# EAGLE schematic DAQShield (EAGLE 9.6.0)
DOCUMENT_NUMBER: tbd; DOCUMENT_REVISION: ( ); RELEASE_DATE: tbd

## Sheet 1 of 6: Arduino Pro Micro
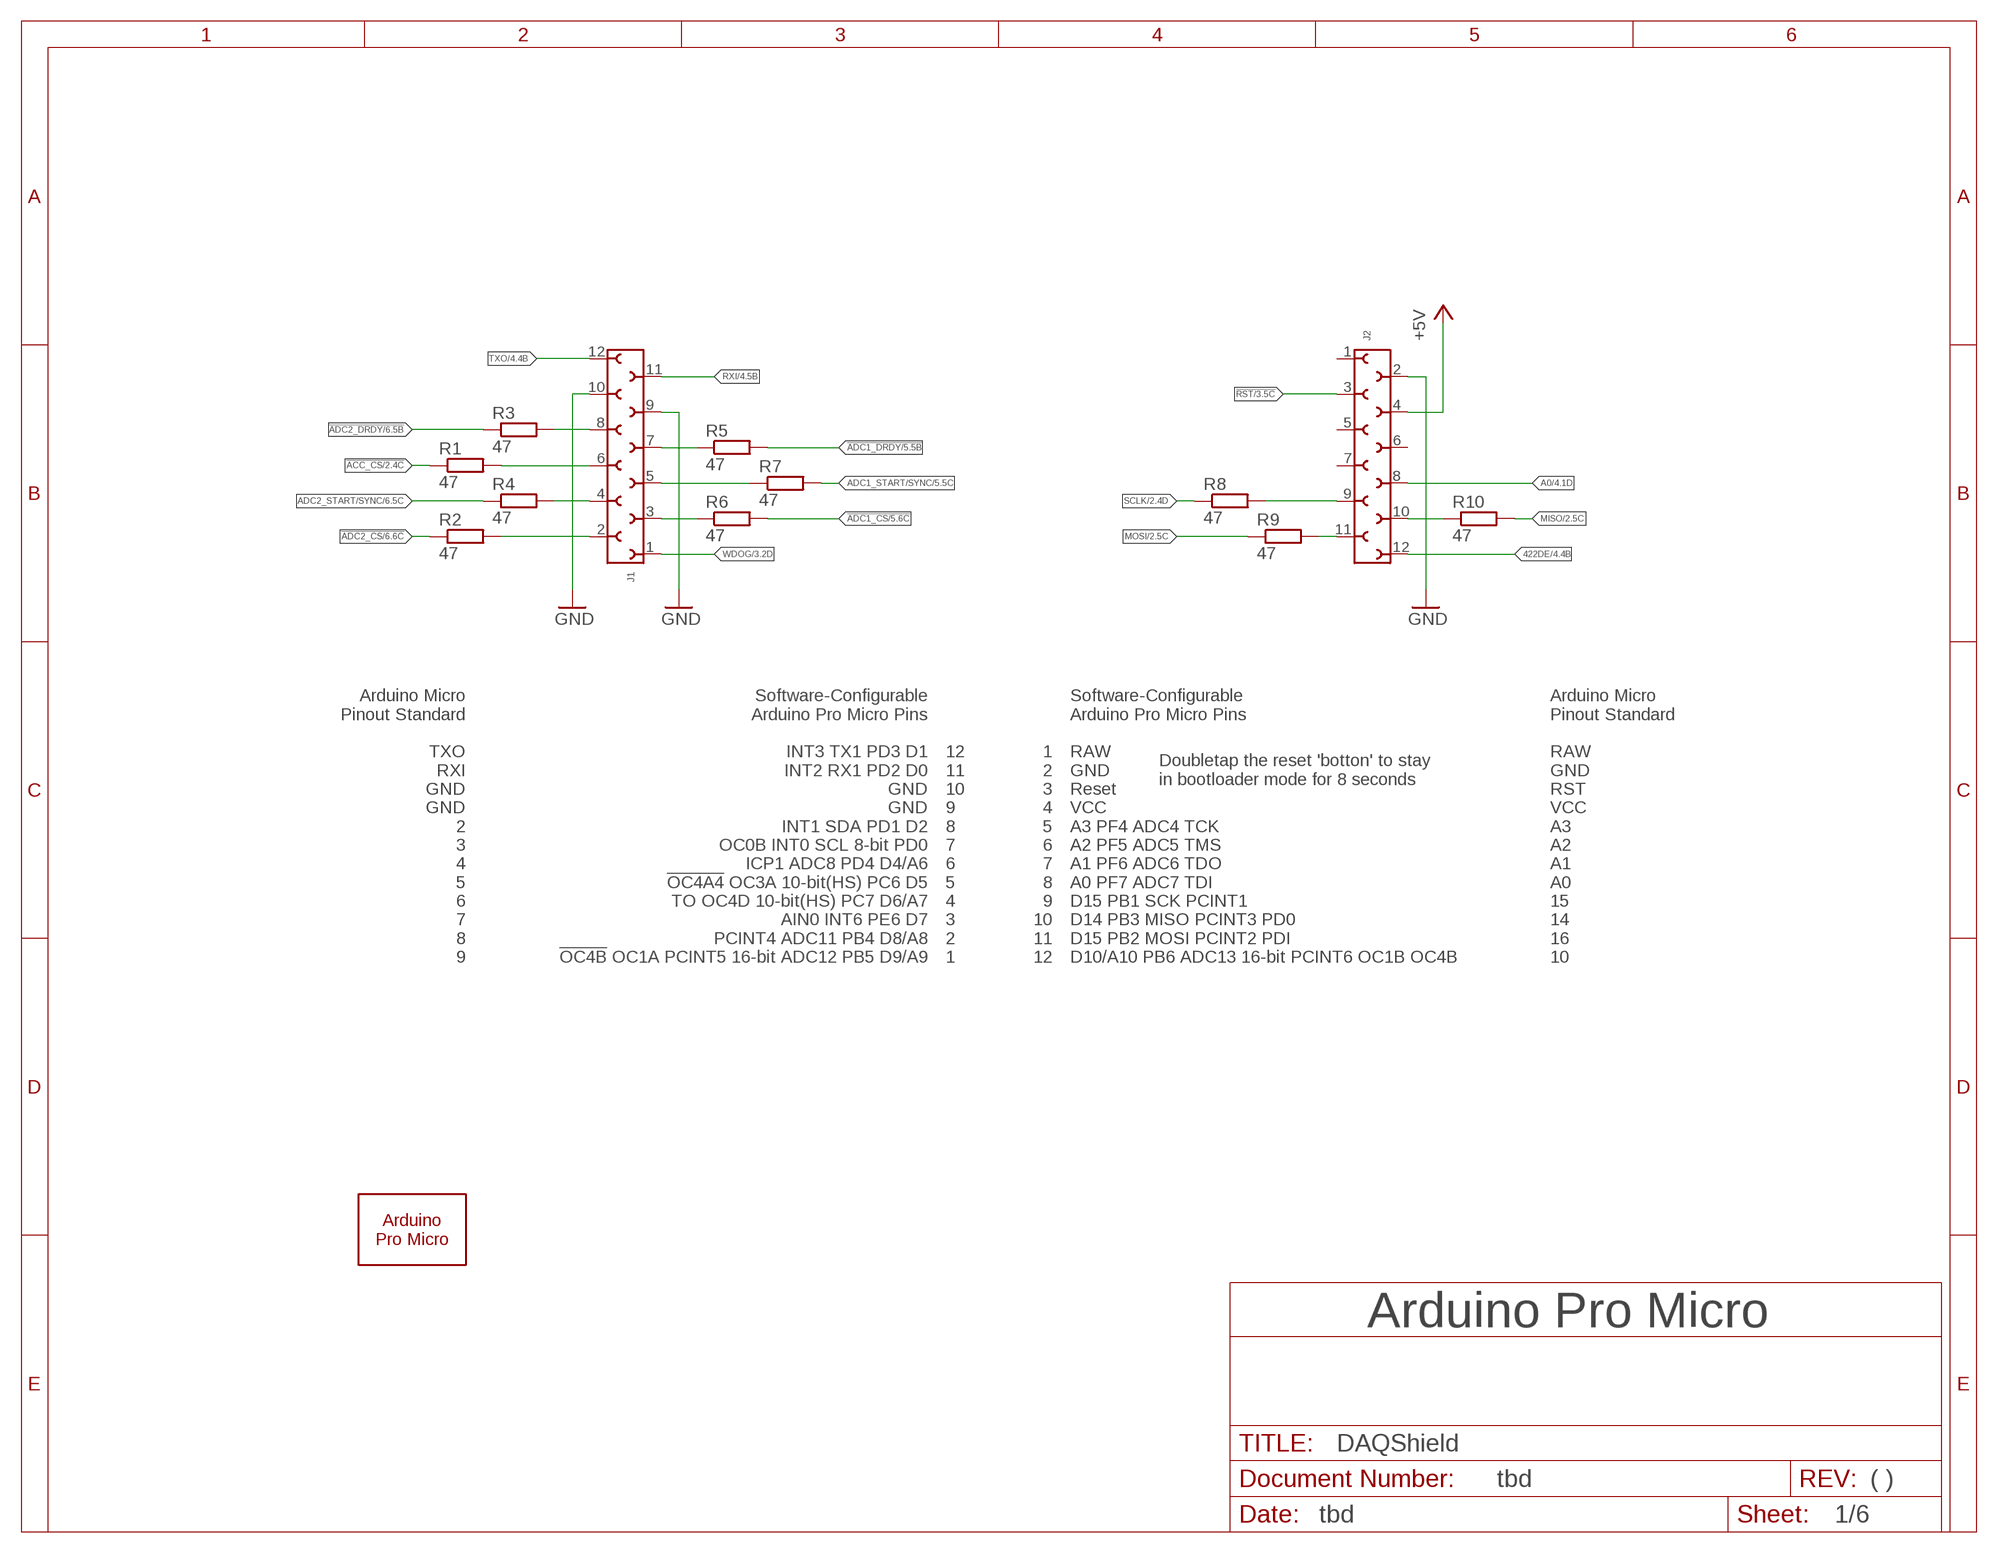
[diagram p0: schematic, sheet 1]

### Parts
A1  ARDUINO_PRO_MICRO  [ARDUINO_PRO_MICRO]
J1  6100XX13321_61001213321  [61001213321]
J2  6100XX13321_61001213321  [61001213321]
R1  47  R-EU_R0603  [R0603]
R2  47  R-EU_R0603  [R0603]
R3  47  R-EU_R0603  [R0603]
R4  47  R-EU_R0603  [R0603]
R5  47  R-EU_R0603  [R0603]
R6  47  R-EU_R0603  [R0603]
R7  47  R-EU_R0603  [R0603]
R8  47  R-EU_R0603  [R0603]
R9  47  R-EU_R0603  [R0603]
R10  47  R-EU_R0603  [R0603]

### Nets
422DE: J2.12 ; also sheet 4
!ACC_CS: R1.1 ; also sheet 2
!ADC1_CS: R6.2 ; also sheet 5
!ADC1_DRDY: R5.2 ; also sheet 5
!ADC2_CS: R2.1 ; also sheet 6
!ADC2_DRDY: R3.1 ; also sheet 6
!RST: J2.3 ; also sheet 3,5,6
+5V [Power]: J2.4 ; also sheet 2,3,4,5,6
A0: J2.8 ; also sheet 4
ADC1_START/SYNC: R7.2 ; also sheet 5
ADC2_START/SYNC: R4.1 ; also sheet 6
GND [Ground]: J1.9 J1.10 J2.2 ; also sheet 2,3,4,5,6
MISO: R10.2 ; also sheet 2,5,6
MOSI: R9.1 ; also sheet 2,5,6
N$19: J2.9 R8.2
N$20: J2.11 R9.2
N$21: J2.10 R10.1
N$22: J1.8 R3.2
N$23: J1.7 R5.1
N$28: J1.4 R4.2
N$32: J1.2 R2.2
N$35: J1.5 R7.1
N$36: J1.3 R6.1
N$41: J1.6 R1.2
RXI: J1.11 ; also sheet 4
SCLK: R8.1 ; also sheet 2,5,6
TXO: J1.12 ; also sheet 4
WDOG: J1.1 ; also sheet 3
Unconnected: J2.1 J2.5 J2.6 J2.7

### Notes on the sheet
- Doubletap the reset 'botton' to stay
  in bootloader mode for 8 seconds
- Arduino Micro
  Pinout Standard
  
  TXO
  RXI
  GND
  GND
  2
  3
  4
  5
  6
  7
  8
  9
- Software-Configurable
  Arduino Pro Micro Pins
  
  INT3 TX1 PD3 D1
  INT2 RX1 PD2 D0
  GND
  GND
  INT1 SDA PD1 D2
  OC0B INT0 SCL 8-bit PD0
  ICP1 ADC8 PD4 D4/A6
  !OC4A4! OC3A 10-bit(HS) PC6 D5
  TO OC4D 10-bit(HS) PC7 D6/A7
  AIN0 INT6 PE6 D7
  PCINT4 ADC11 PB4 D8/A8
  !OC4B! OC1A PCINT5 16-bit ADC12 PB5 D9/A9
- 12
  11
  10
  9
  8
  7
  6
  5
  4
  3
  2
  1
- 1
  2
  3
  4
  5
  6
  7
  8
  9
  10
  11
  12
- Software-Configurable
  Arduino Pro Micro Pins
  
  RAW
  GND
  Reset
  VCC
  A3 PF4 ADC4 TCK
  A2 PF5 ADC5 TMS
  A1 PF6 ADC6 TDO
  A0 PF7 ADC7 TDI
  D15 PB1 SCK PCINT1
  D14 PB3 MISO PCINT3 PD0
  D15 PB2 MOSI PCINT2 PDI
  D10/A10 PB6 ADC13 16-bit PCINT6 OC1B OC4B
- Arduino Micro
  Pinout Standard
  
  RAW
  GND
  RST
  VCC
  A3
  A2
  A1
  A0
  15
  14
  16
  10

## Sheet 2 of 6: Connectors
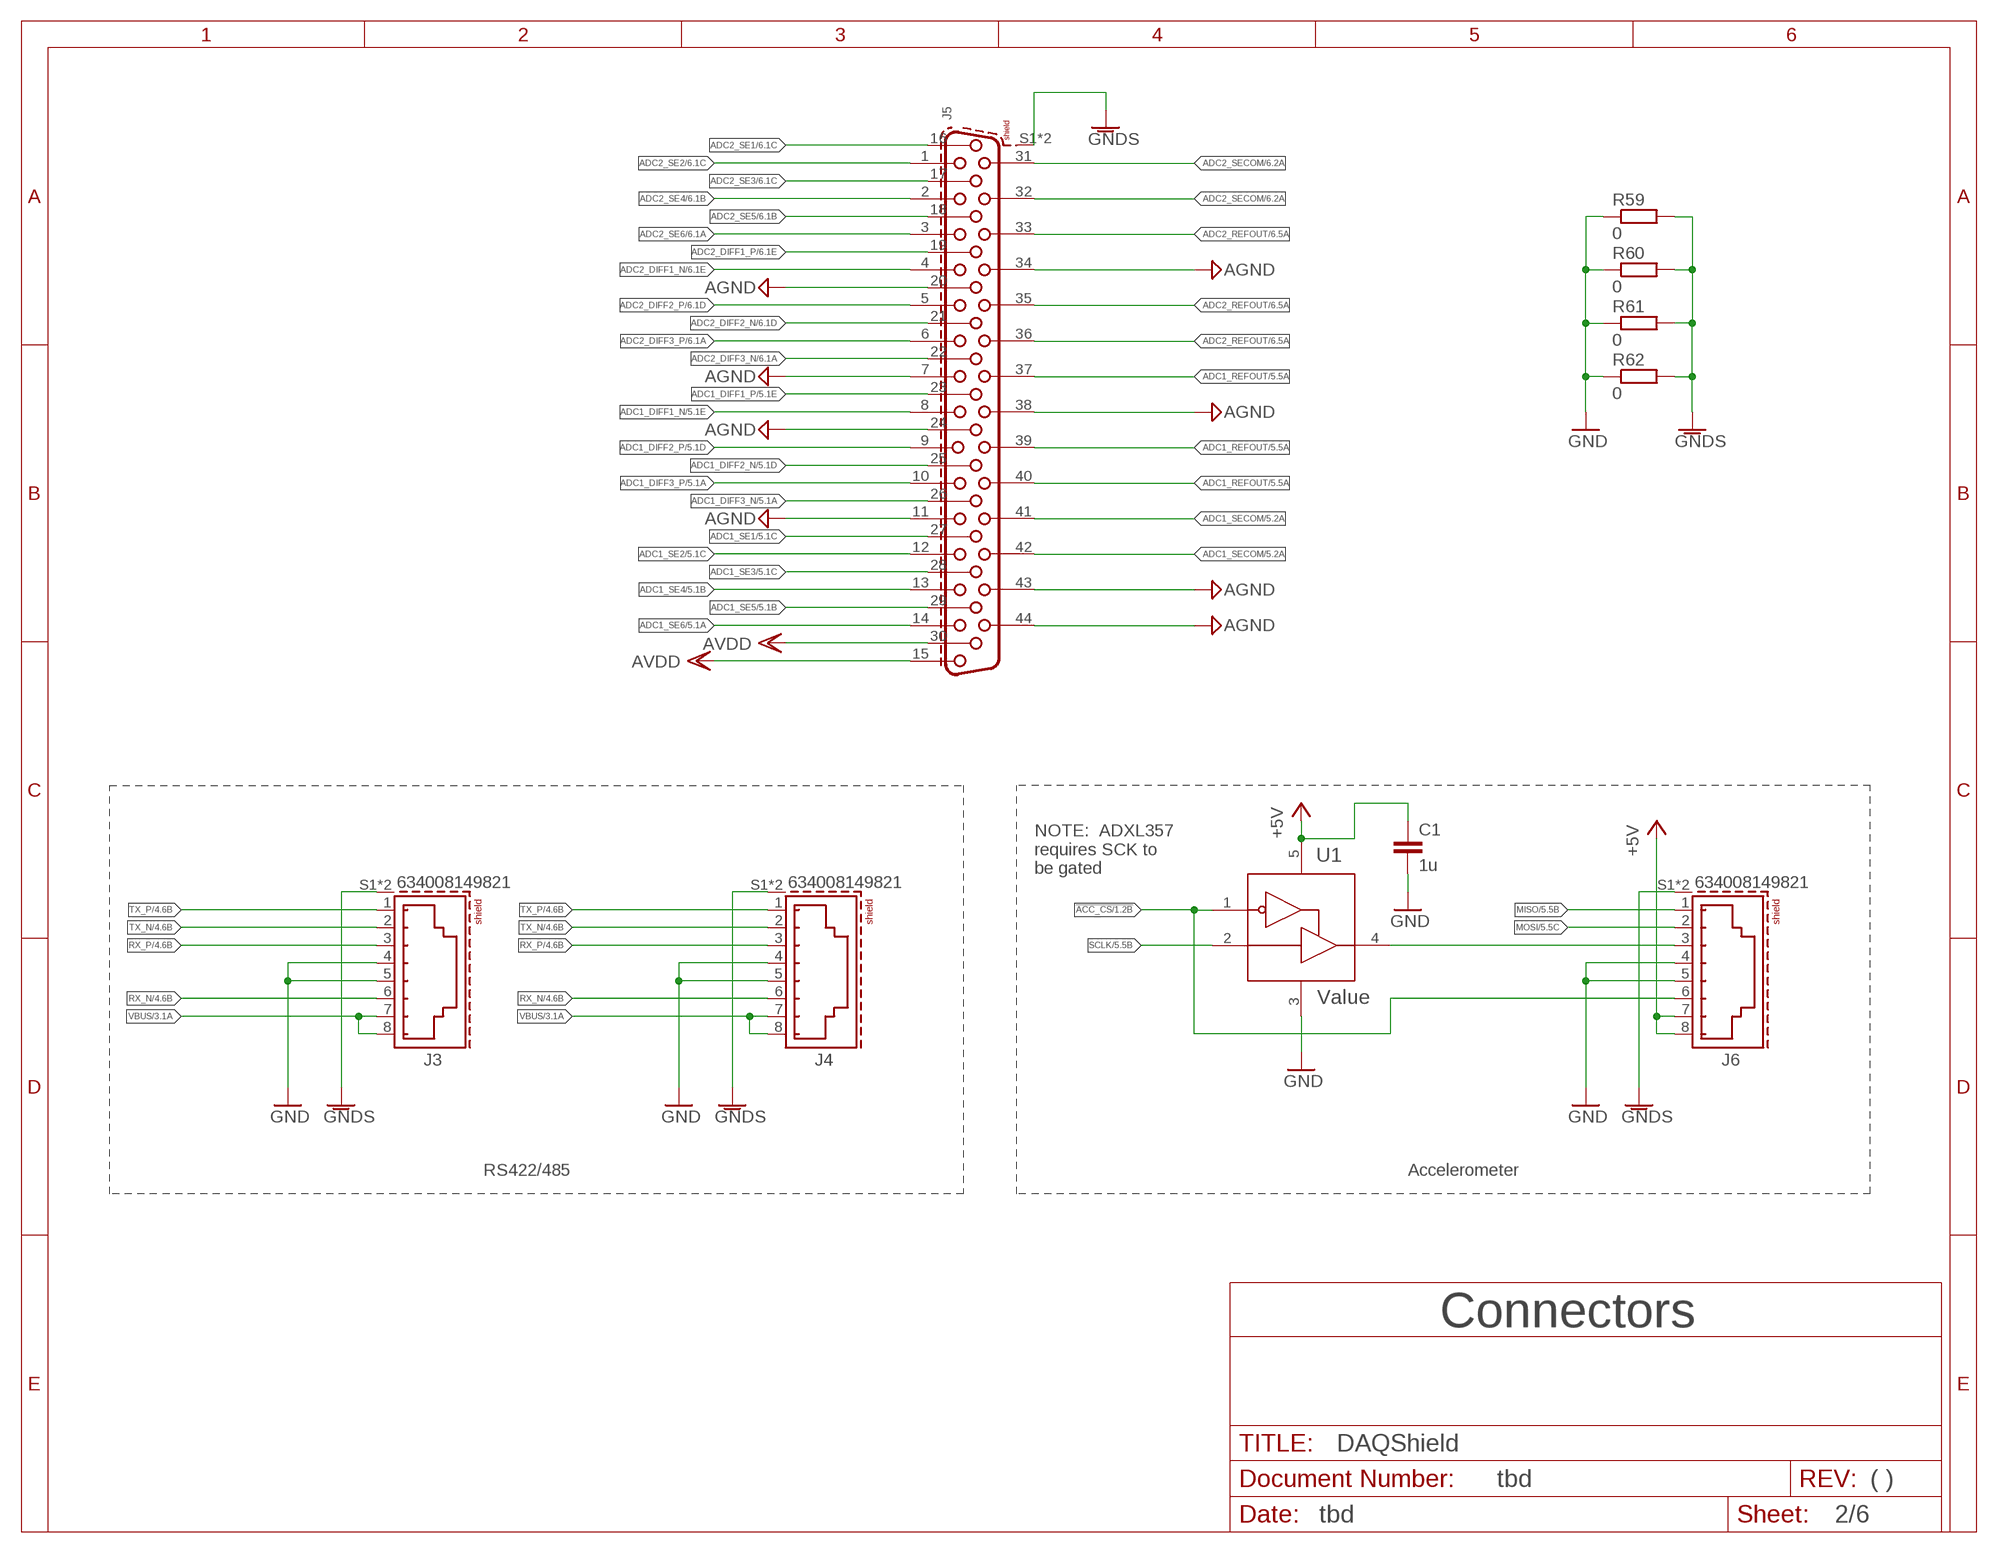
[diagram p1: schematic, sheet 2]

### Parts
C1  1u  C-EUC0603  [C0603]
J3  634008149821  [634008149821]
J4  634008149821  [634008149821]
J5  6180XX330923_618044330923  [618044330923]
J6  634008149821  [634008149821]
R59  0  R-EU_R1206  [R1206]
R60  0  R-EU_R1206  [R1206]
R61  0  R-EU_R1206  [R1206]
R62  0  R-EU_R1206  [R1206]
U1  Value  74LVC1G125DBVRE4  [DBV0005A_N]

### Nets
!ACC_CS: J6.6 U1.1(OE_N) ; also sheet 1
+5V [Power]: C1.1 J6.7 J6.8 U1.5(VCC) ; also sheet 1,3,4,5,6
ACC_SCLK: J6.3 U1.4(Y)
ADC1_DIFF1_N [diff pairs]: J5.8 ; also sheet 5
ADC1_DIFF1_P [diff pairs]: J5.23 ; also sheet 5
ADC1_DIFF2_N [diff pairs]: J5.25 ; also sheet 5
ADC1_DIFF2_P [diff pairs]: J5.9 ; also sheet 5
ADC1_DIFF3_N [diff pairs]: J5.26 ; also sheet 5
ADC1_DIFF3_P [diff pairs]: J5.10 ; also sheet 5
ADC1_REFOUT: J5.37 J5.39 J5.40 ; also sheet 5
ADC1_SE1: J5.27 ; also sheet 5
ADC1_SE2: J5.12 ; also sheet 5
ADC1_SE3: J5.28 ; also sheet 5
ADC1_SE4: J5.13 ; also sheet 5
ADC1_SE5: J5.29 ; also sheet 5
ADC1_SE6: J5.14 ; also sheet 5
ADC1_SECOM: J5.41 J5.42 ; also sheet 5
ADC2_DIFF1_N [diff pairs]: J5.4 ; also sheet 6
ADC2_DIFF1_P [diff pairs]: J5.19 ; also sheet 6
ADC2_DIFF2_N [diff pairs]: J5.21 ; also sheet 6
ADC2_DIFF2_P [diff pairs]: J5.5 ; also sheet 6
ADC2_DIFF3_N [diff pairs]: J5.22 ; also sheet 6
ADC2_DIFF3_P [diff pairs]: J5.6 ; also sheet 6
ADC2_REFOUT: J5.33 J5.35 J5.36 ; also sheet 6
ADC2_SE1: J5.16 ; also sheet 6
ADC2_SE2: J5.1 ; also sheet 6
ADC2_SE3: J5.17 ; also sheet 6
ADC2_SE4: J5.2 ; also sheet 6
ADC2_SE5: J5.18 ; also sheet 6
ADC2_SE6: J5.3 ; also sheet 6
ADC2_SECOM: J5.31 J5.32 ; also sheet 6
AGND [Ground]: J5.7 J5.11 J5.20 J5.24 J5.34 J5.38 J5.43 J5.44 ; also sheet 5,6
AVDD [Power]: J5.15 J5.30 ; also sheet 5,6
GND [Ground]: C1.2 J3.4 J3.5 J4.4 J4.5 J6.4 J6.5 R59.1 R60.1 R61.1 R62.1 U1.3(GND) ; also sheet 1,3,4,5,6
GNDS [Ground]: J3.S1(SHIELD) J3.S2(SHIELD) J4.S1(SHIELD) J4.S2(SHIELD) J5.S1(SHIELD) J5.S2(SHIELD) J6.S1(SHIELD) J6.S2(SHIELD) R59.2 R60.2 R61.2 R62.2
MISO: J6.1 ; also sheet 1,5,6
MOSI: J6.2 ; also sheet 1,5,6
RX_N [diff pairs]: J3.6 J4.6 ; also sheet 4
RX_P [diff pairs]: J3.3 J4.3 ; also sheet 4
SCLK: U1.2(A) ; also sheet 1,5,6
TX_N [diff pairs]: J3.2 J4.2 ; also sheet 4
TX_P [diff pairs]: J3.1 J4.1 ; also sheet 4
VBUS [Power]: J3.7 J3.8 J4.7 J4.8 ; also sheet 3

### Notes on the sheet
- NOTE:  ADXL357
  requires SCK to
  be gated
- RS422/485 | Accelerometer

## Sheet 3 of 6: Power and Watchdog
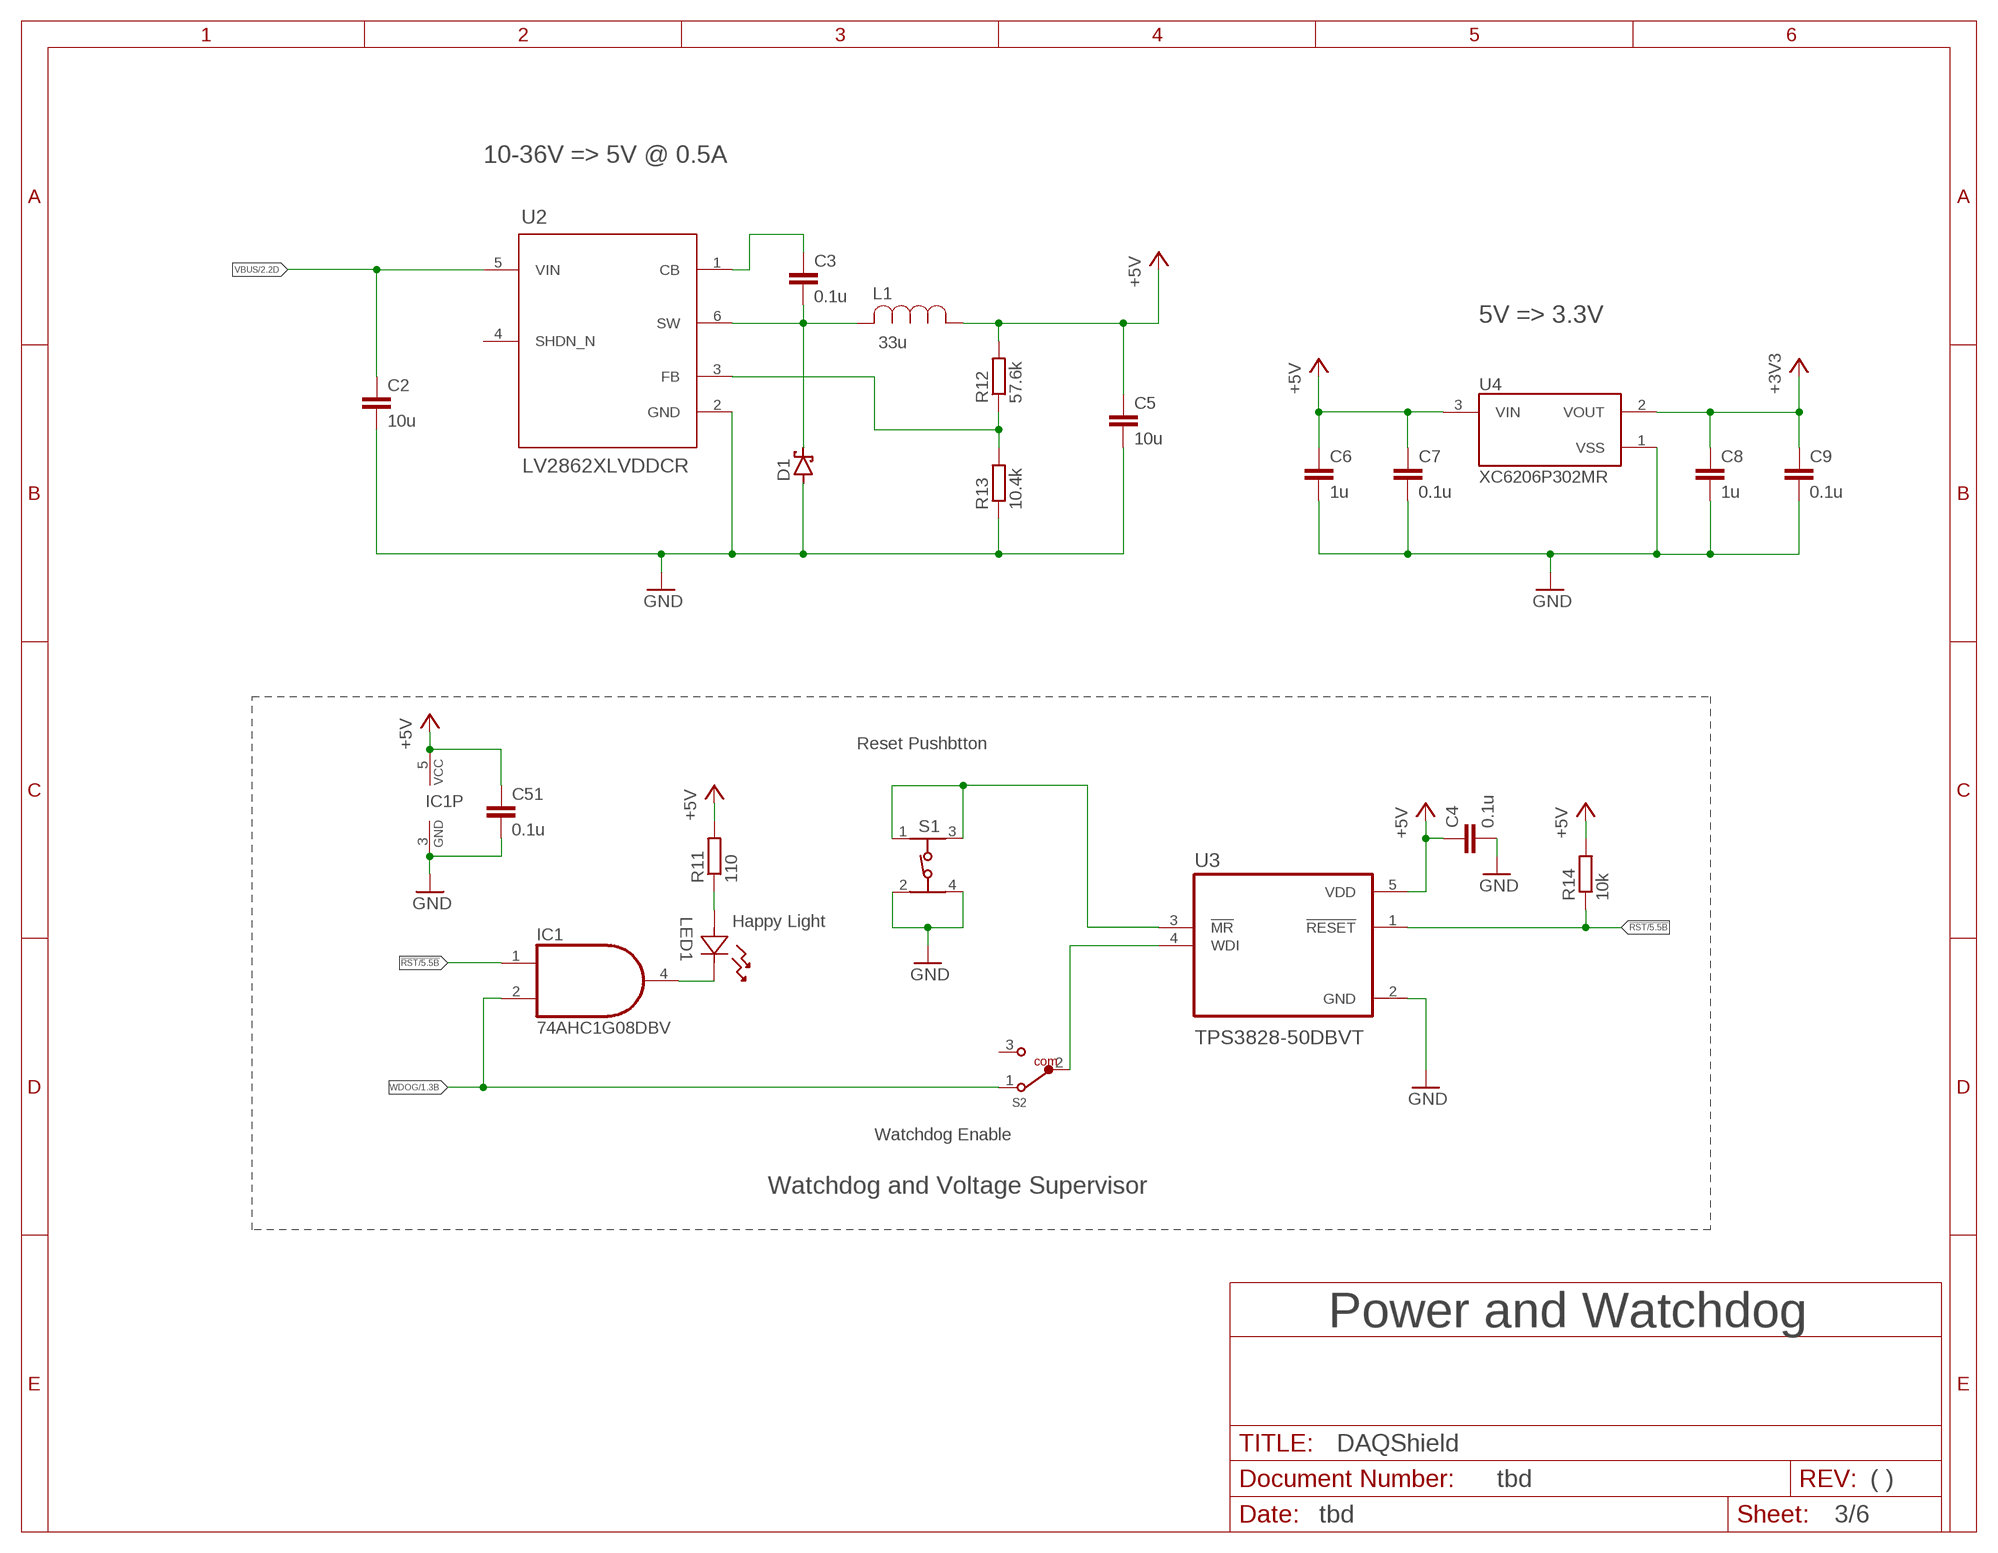
[diagram p2: schematic, sheet 3]

### Parts
C2  10u  C-EUC1210  [C1210]
C3  0.1u  C-EUC0805  [C0805]
C4  0.1u  C-EUC0603  [C0603]
C5  10u  C-EUC0805  [C0805]
C6  1u  C-EUC0603  [C0603]
C7  0.1u  C-EUC0603  [C0603]
C8  1u  C-EUC0603  [C0603]
C9  0.1u  C-EUC0603  [C0603]
C51  0.1u  C-EUC0603  [C0603]
D1  PMEG6010CEH,115  SMF5.0AT1  [SOD123FL]
IC1  74AHC1G08DBV  [SOT23-5]
L1  33u  SRU8043-XXXX  [IND_BOURNS_SRU8043]
LED1  APA1606QBC/D  [LED_APA1606_KNB]
R11  110  R-EU_R0603  [R0603]
R12  57.6k  R-EU_R0402  [R0402]
R13  10.4k  R-EU_R0805  [R0805]
R14  10k  R-EU_R0603  [R0603]
S1  434153017835  [434153017835]
S2  450404015514  [450404015514]
U2  LV2862XLVDDCR  LV2862XLVDDCR  [DDC0006A-IPC_A]
U3  TPS3828-50DBVT  [SOT95P280X145-5N]
U4  XC6206P302MR  [SOT95P280X130-3N]

### Nets
!RST: IC1.1(I0) R14.1 U3.1(!RESET) ; also sheet 1,5,6
+3V3 [Power]: C8.1 C9.1 U4.2(VOUT) ; also sheet 5,6
+5V [Power]: C4.1 C5.1 C6.1 C7.1 C51.1 IC1.5(VCC) L1.1 R11.2 R12.2 R14.2 U3.5(VDD) U4.3(VIN) ; also sheet 1,2,4,5,6
GND [Ground]: C2.2 C4.2 C5.2 C6.2 C7.2 C8.2 C9.2 C51.2 D1.A IC1.3(GND) R13.1 S1.2 S1.4 U2.2(GND) U3.2(GND) U4.1(VSS) ; also sheet 1,2,4,5,6
N$1: C3.1 U2.1(CB)
N$2: C3.2 D1.C L1.2 U2.6(SW)
N$3: R12.1 R13.2 U2.3(FB)
N$4: S1.1 S1.3 U3.3(!MR)
N$5: S2.2 U3.4(WDI)
N$6: IC1.4(O) LED1.1
N$7: LED1.2 R11.1
VBUS [Power]: C2.1 U2.5(VIN) ; also sheet 2
WDOG: IC1.2(I1) S2.1 ; also sheet 1
Unconnected: S2.3 U2.4(SHDN_N)

### Notes on the sheet
- 10-36V => 5V @ 0.5A
- 5V => 3.3V
- Reset Pushbtton
- Happy Light
- Watchdog Enable
- Watchdog and Voltage Supervisor

## Sheet 4 of 6: RS4xx
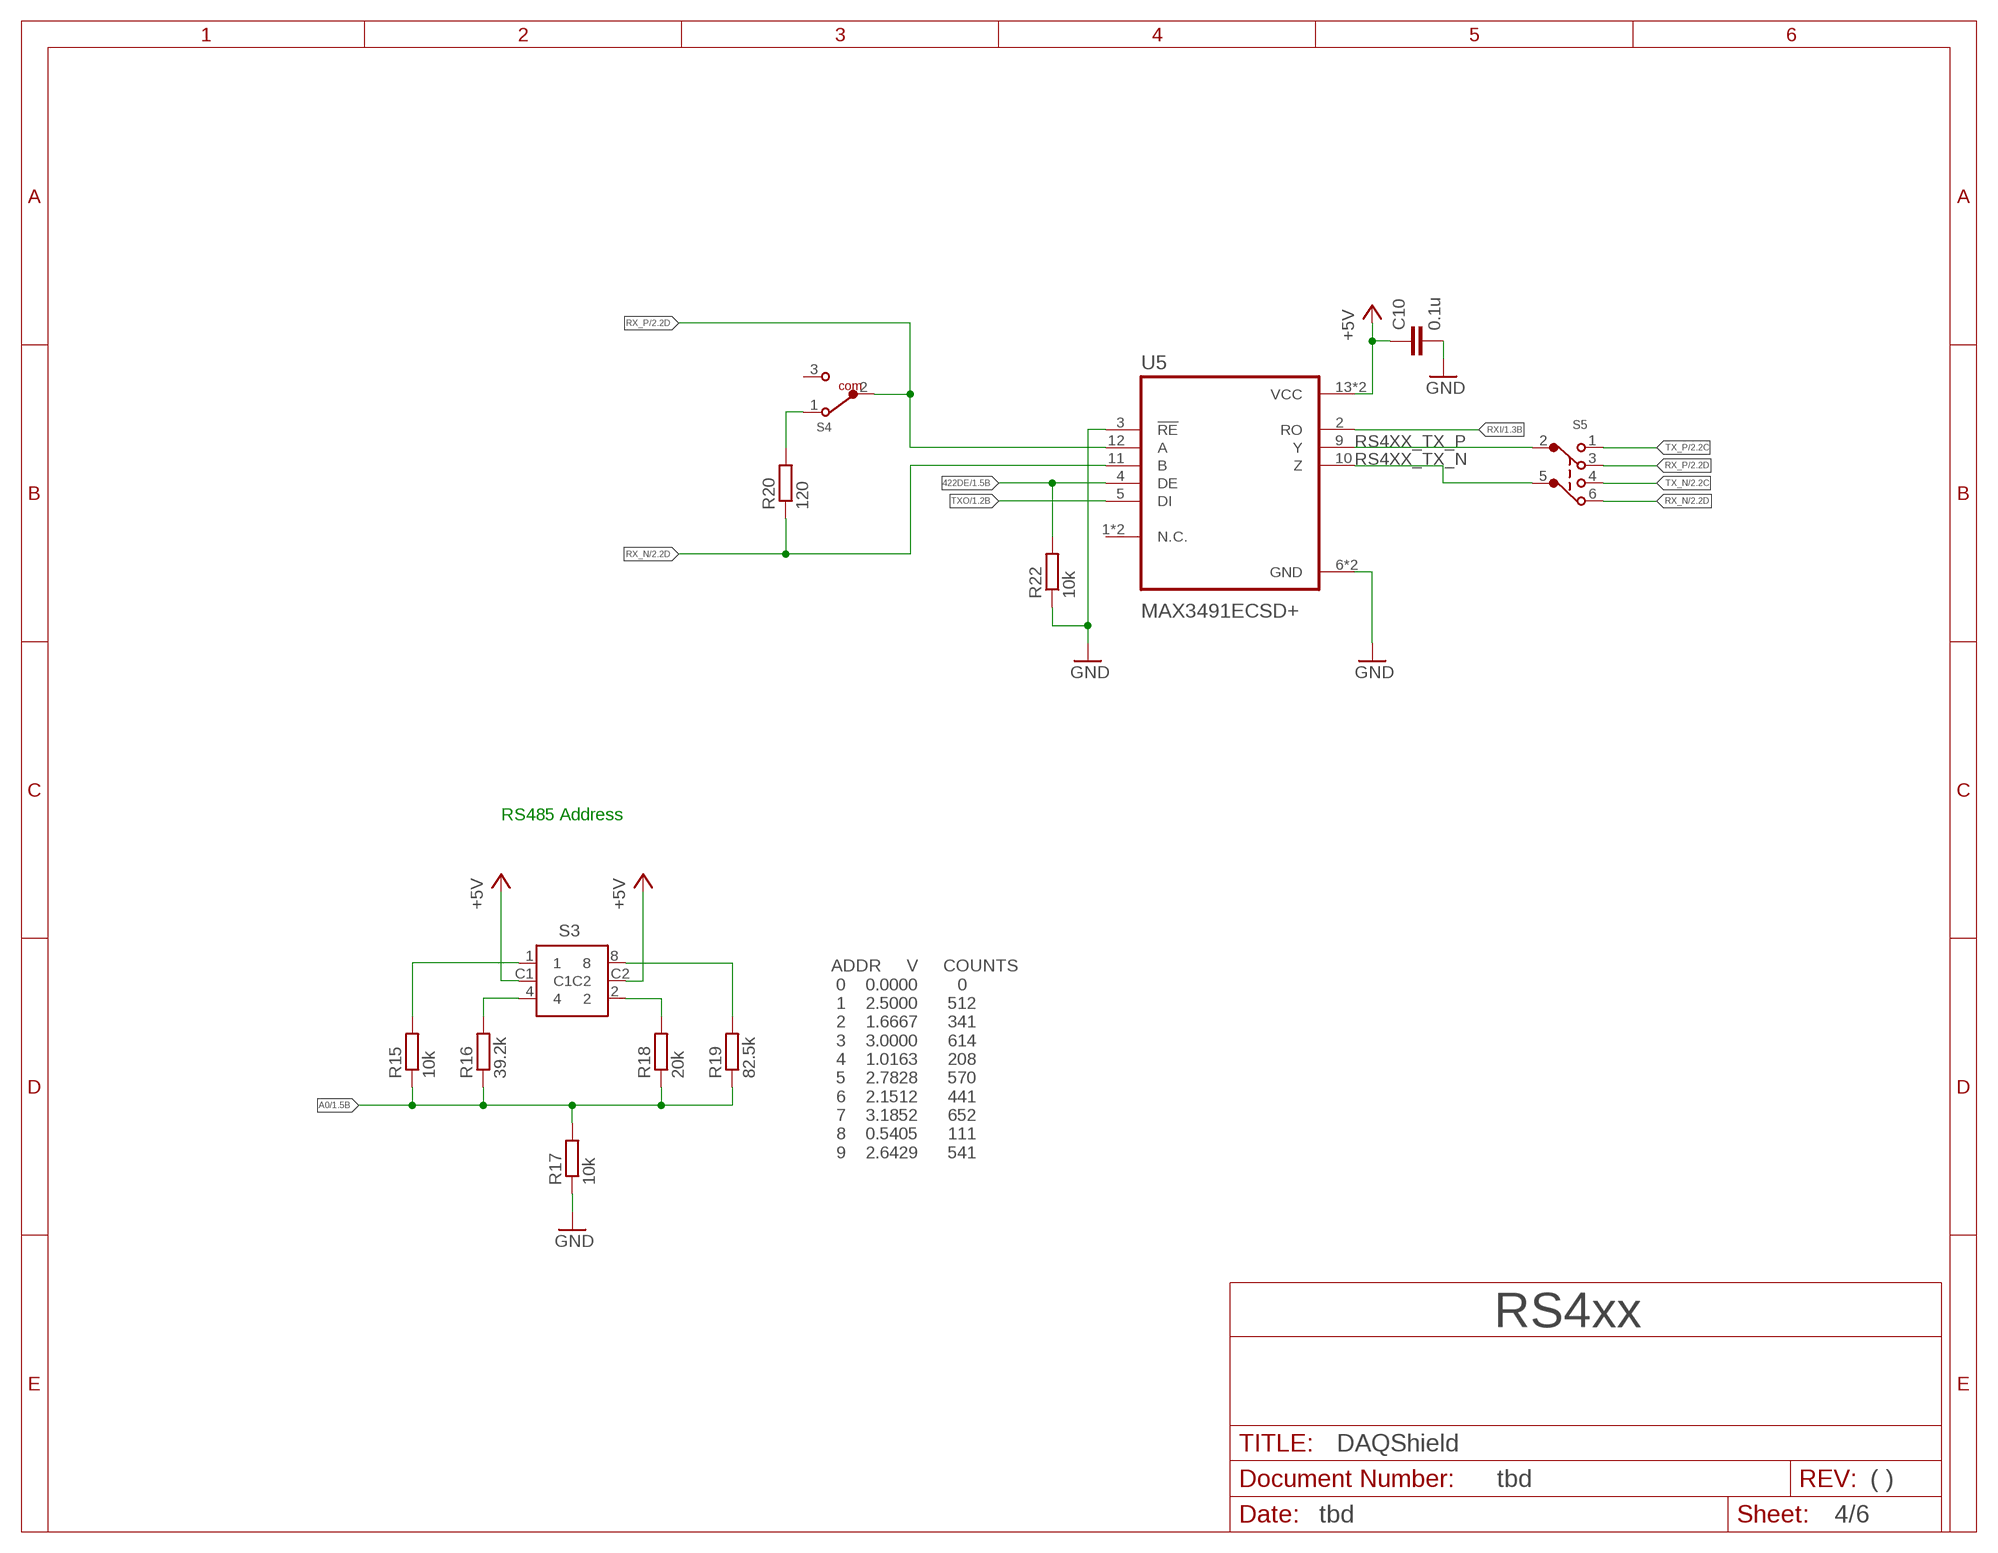
[diagram p3: schematic, sheet 4]

### Parts
C10  0.1u  C-EUC0603  [C0603]
R15  10k  R-EU_R0603  [R0603]
R16  39.2k  R-EU_R0603  [R0603]
R17  10k  R-EU_R0603  [R0603]
R18  20k  R-EU_R0603  [R0603]
R19  82.5k  R-EU_R0603  [R0603]
R20  120  R-EU_R0603  [R0603]
R22  10k  R-EU_R0603  [R0603]
S3  428427320910  [42842732091X_10POS]
S4  450404015514  [450404015514]
S5  452403012014  [452403012014]
U5  MAX3491ECSD+  [SOIC127P600X175-14N]

### Nets
422DE: R22.2 U5.4(DE) ; also sheet 1
+5V [Power]: C10.1 S3.C1 S3.C2 U5.13(VCC) U5.14(VCC) ; also sheet 1,2,3,5,6
A0: R15.1 R16.1 R17.2 R18.1 R19.1 ; also sheet 1
GND [Ground]: C10.2 R17.1 R22.1 U5.3(!RE) U5.6(GND) U5.7(GND) ; also sheet 1,2,3,5,6
N$18: R20.2 S4.1
N$37: R15.2 S3.1
N$38: R16.2 S3.4
N$39: R19.2 S3.8
N$40: R18.2 S3.2
RS4XX_TX_N [diff pairs]: S5.5 U5.10(Z)
RS4XX_TX_P [diff pairs]: S5.2 U5.9(Y)
RX_N [diff pairs]: R20.1 S5.6 U5.11(B) ; also sheet 2
RX_P [diff pairs]: S4.2 S5.3 U5.12(A) ; also sheet 2
RXI: U5.2(RO) ; also sheet 1
TX_N [diff pairs]: S5.4 ; also sheet 2
TX_P [diff pairs]: S5.1 ; also sheet 2
TXO: U5.5(DI) ; also sheet 1
Unconnected: S4.3 U5.1(N.C.) U5.8(N.C.)

### Notes on the sheet
- RS485 Address
- ADDR     V     COUNTS
     0    0.0000        0
     1    2.5000      512
     2    1.6667      341
     3    3.0000      614
     4    1.0163      208
     5    2.7828      570
     6    2.1512      441
     7    3.1852      652
     8    0.5405      111
     9    2.6429      541

## Sheet 5 of 6: 16-bit ADC #1
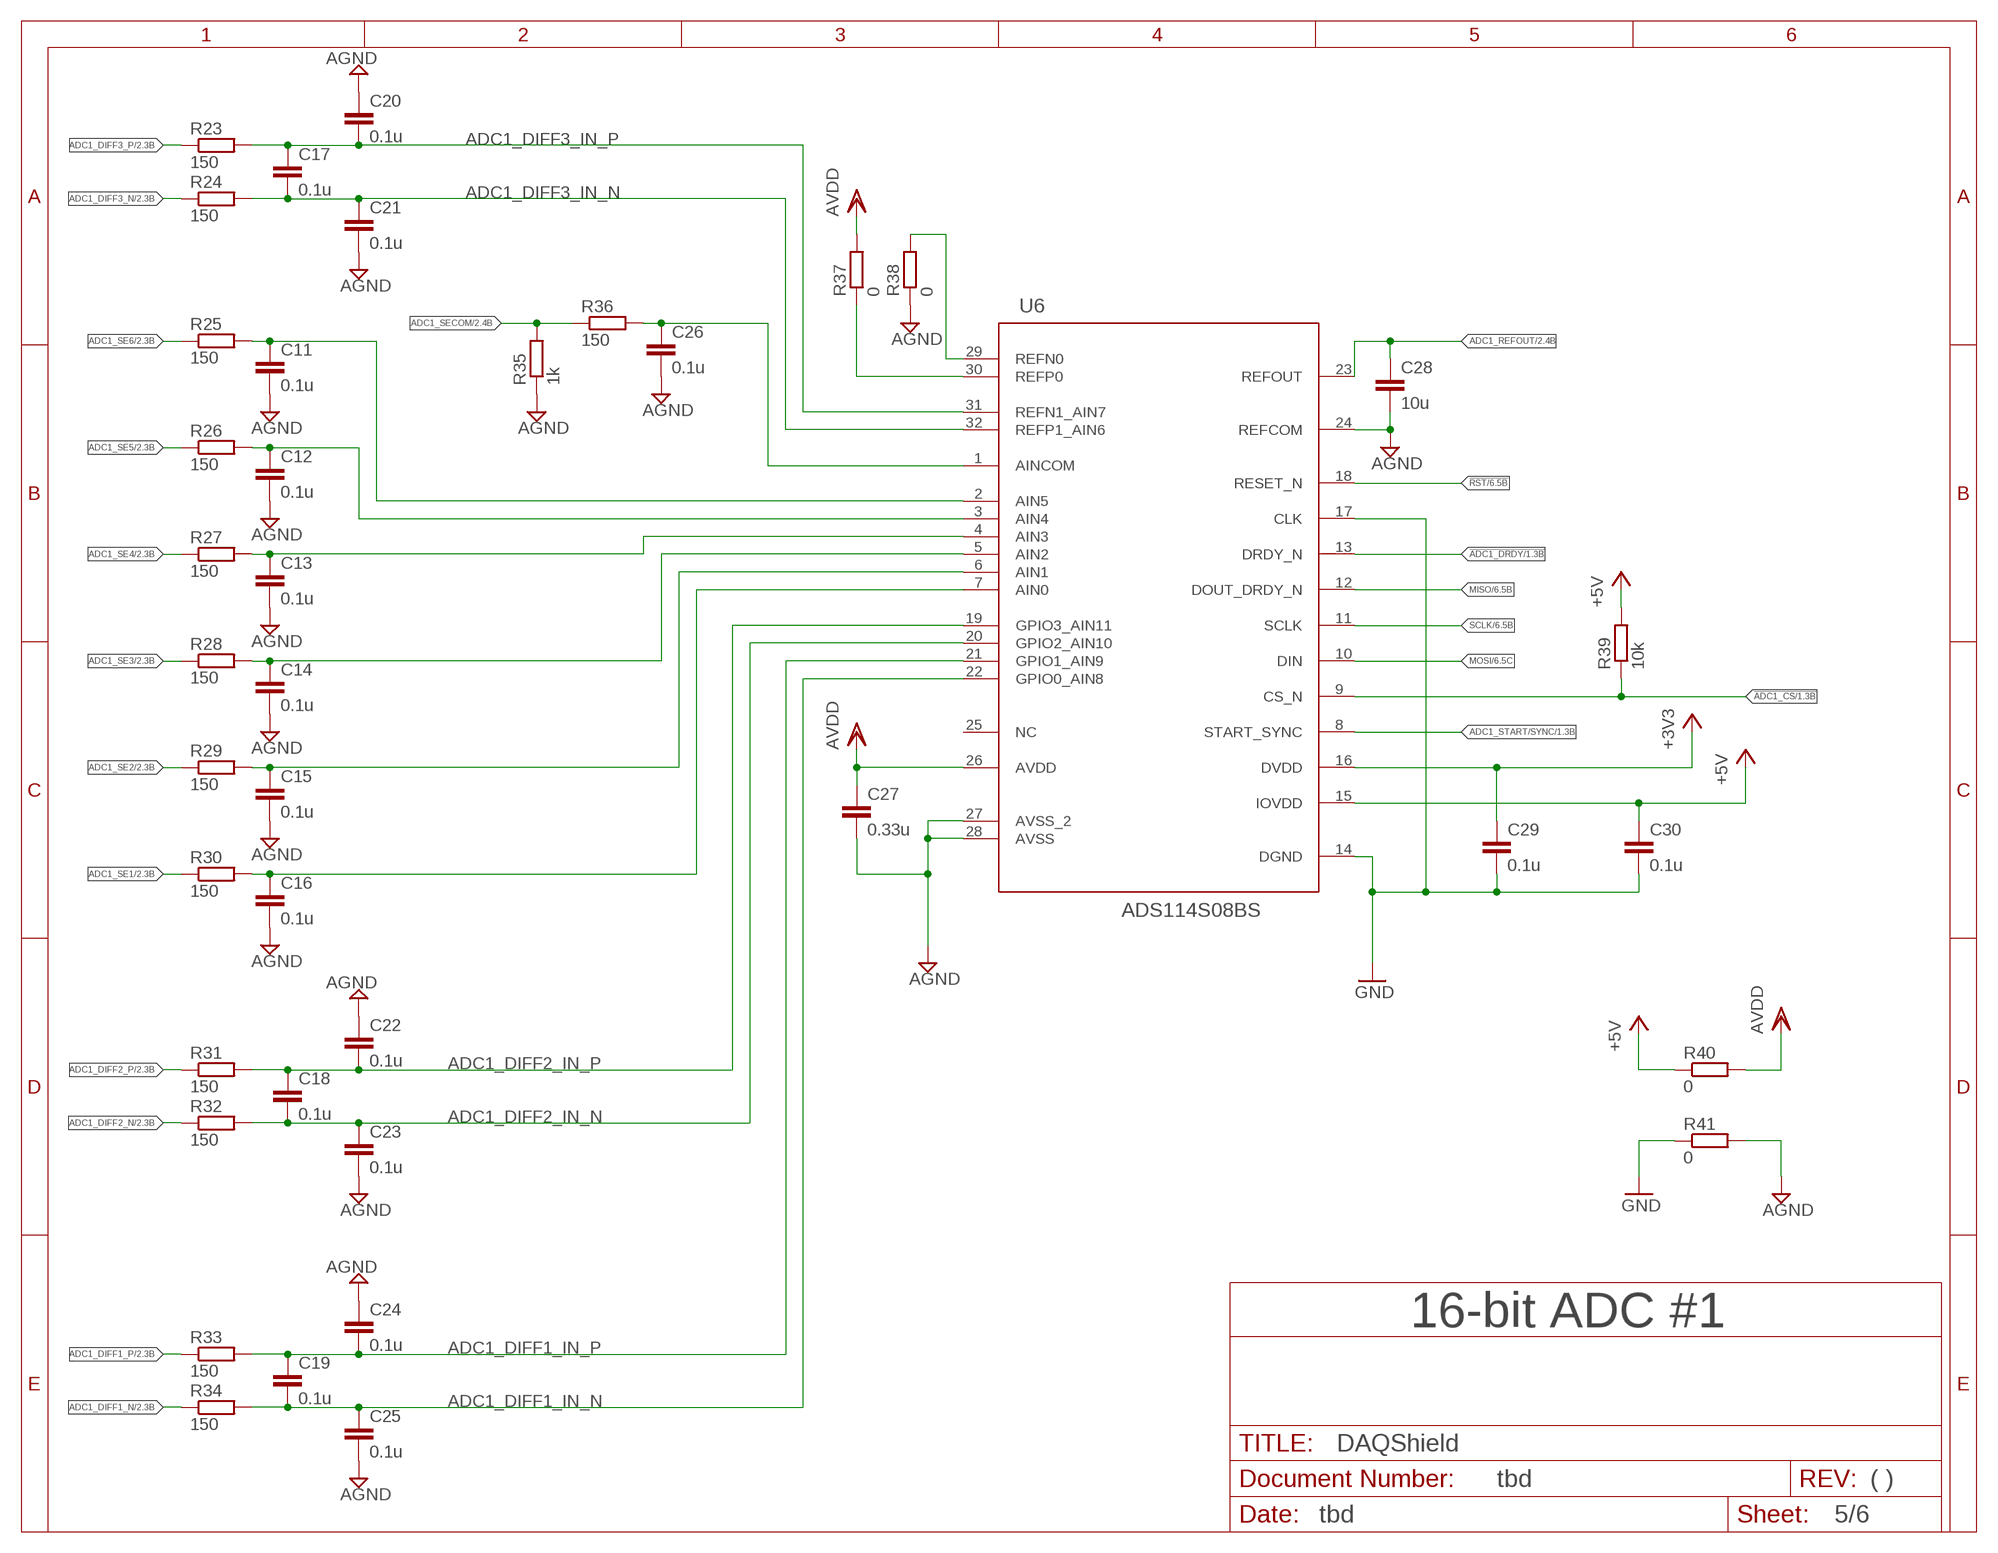
[diagram p4: schematic, sheet 5]

### Parts
C11  0.1u  C-EUC0603  [C0603]
C12  0.1u  C-EUC0603  [C0603]
C13  0.1u  C-EUC0603  [C0603]
C14  0.1u  C-EUC0603  [C0603]
C15  0.1u  C-EUC0603  [C0603]
C16  0.1u  C-EUC0603  [C0603]
C17  0.1u  C-EUC0603  [C0603]
C18  0.1u  C-EUC0603  [C0603]
C19  0.1u  C-EUC0603  [C0603]
C20  0.1u  C-EUC0603  [C0603]
C21  0.1u  C-EUC0603  [C0603]
C22  0.1u  C-EUC0603  [C0603]
C23  0.1u  C-EUC0603  [C0603]
C24  0.1u  C-EUC0603  [C0603]
C25  0.1u  C-EUC0603  [C0603]
C26  0.1u  C-EUC0603  [C0603]
C27  0.33u  C-EUC0603  [C0603]
C28  10u  C-EUC0603  [C0603]
C29  0.1u  C-EUC0603  [C0603]
C30  0.1u  C-EUC0603  [C0603]
R23  150  R-EU_R0603  [R0603]
R24  150  R-EU_R0603  [R0603]
R25  150  R-EU_R0603  [R0603]
R26  150  R-EU_R0603  [R0603]
R27  150  R-EU_R0603  [R0603]
R28  150  R-EU_R0603  [R0603]
R29  150  R-EU_R0603  [R0603]
R30  150  R-EU_R0603  [R0603]
R31  150  R-EU_R0603  [R0603]
R32  150  R-EU_R0603  [R0603]
R33  150  R-EU_R0603  [R0603]
R34  150  R-EU_R0603  [R0603]
R35  1k  R-EU_R0603  [R0603]
R36  150  R-EU_R0603  [R0603]
R37  0  R-EU_R0603  [R0603]
R38  0  R-EU_R0603  [R0603]
R39  10k  R-EU_R0603  [R0603]
R40  0  R-EU_R1206  [R1206]
R41  0  R-EU_R1206  [R1206]
U6  ADS114S08BS  ADS114S08BIPBS  [PBS0032A_N]

### Nets
!ADC1_CS: R39.1 U6.9(CS_N) ; also sheet 1
!ADC1_DRDY: U6.13(DRDY_N) ; also sheet 1
!RST: U6.18(RESET_N) ; also sheet 1,3,6
+3V3 [Power]: C29.1 U6.16(DVDD) ; also sheet 3,6
+5V [Power]: C30.1 R39.2 R40.1 U6.15(IOVDD) ; also sheet 1,2,3,4,6
ADC1_DIFF1_IN_N [diff pairs]: C19.2 C25.1 R34.2 U6.22(GPIO0_AIN8)
ADC1_DIFF1_IN_P [diff pairs]: C19.1 C24.2 R33.2 U6.21(GPIO1_AIN9)
ADC1_DIFF1_N [diff pairs]: R34.1 ; also sheet 2
ADC1_DIFF1_P [diff pairs]: R33.1 ; also sheet 2
ADC1_DIFF2_IN_N [diff pairs]: C18.2 C23.1 R32.2 U6.20(GPIO2_AIN10)
ADC1_DIFF2_IN_P [diff pairs]: C18.1 C22.2 R31.2 U6.19(GPIO3_AIN11)
ADC1_DIFF2_N [diff pairs]: R32.1 ; also sheet 2
ADC1_DIFF2_P [diff pairs]: R31.1 ; also sheet 2
ADC1_DIFF3_IN_N [diff pairs]: C17.2 C21.1 R24.2 U6.32(REFP1_AIN6)
ADC1_DIFF3_IN_P [diff pairs]: C17.1 C20.2 R23.2 U6.31(REFN1_AIN7)
ADC1_DIFF3_N [diff pairs]: R24.1 ; also sheet 2
ADC1_DIFF3_P [diff pairs]: R23.1 ; also sheet 2
ADC1_REFOUT: C28.1 U6.23(REFOUT) ; also sheet 2
ADC1_SE1: R30.1 ; also sheet 2
ADC1_SE2: R29.1 ; also sheet 2
ADC1_SE3: R28.1 ; also sheet 2
ADC1_SE4: R27.1 ; also sheet 2
ADC1_SE5: R26.1 ; also sheet 2
ADC1_SE6: R25.1 ; also sheet 2
ADC1_SECOM: R35.2 R36.1 ; also sheet 2
ADC1_START/SYNC: U6.8(START_SYNC) ; also sheet 1
AGND [Ground]: C11.2 C12.2 C13.2 C14.2 C15.2 C16.2 C20.1 C21.2 C22.1 C23.2 C24.1 C25.2 C26.2 C27.2 C28.2 R35.1 R38.1 R41.2 U6.24(REFCOM) U6.27(AVSS_2) U6.28(AVSS) ; also sheet 2,6
AVDD [Power]: C27.1 R37.2 R40.2 U6.26(AVDD) ; also sheet 2,6
GND [Ground]: C29.2 C30.2 R41.1 U6.14(DGND) U6.17(CLK) ; also sheet 1,2,3,4,6
MISO: U6.12(DOUT_DRDY_N) ; also sheet 1,2,6
MOSI: U6.10(DIN) ; also sheet 1,2,6
N$42: R37.1 U6.30(REFP0)
N$43: R38.2 U6.29(REFN0)
N$54: C16.1 R30.2 U6.7(AIN0)
N$55: C15.1 R29.2 U6.6(AIN1)
N$56: C14.1 R28.2 U6.5(AIN2)
N$57: C13.1 R27.2 U6.4(AIN3)
N$58: C12.1 R26.2 U6.3(AIN4)
N$59: C11.1 R25.2 U6.2(AIN5)
N$60: C26.1 R36.2 U6.1(AINCOM)
SCLK: U6.11(SCLK) ; also sheet 1,2,6
Unconnected: U6.25(NC)

## Sheet 6 of 6: 16-bit ADC #2
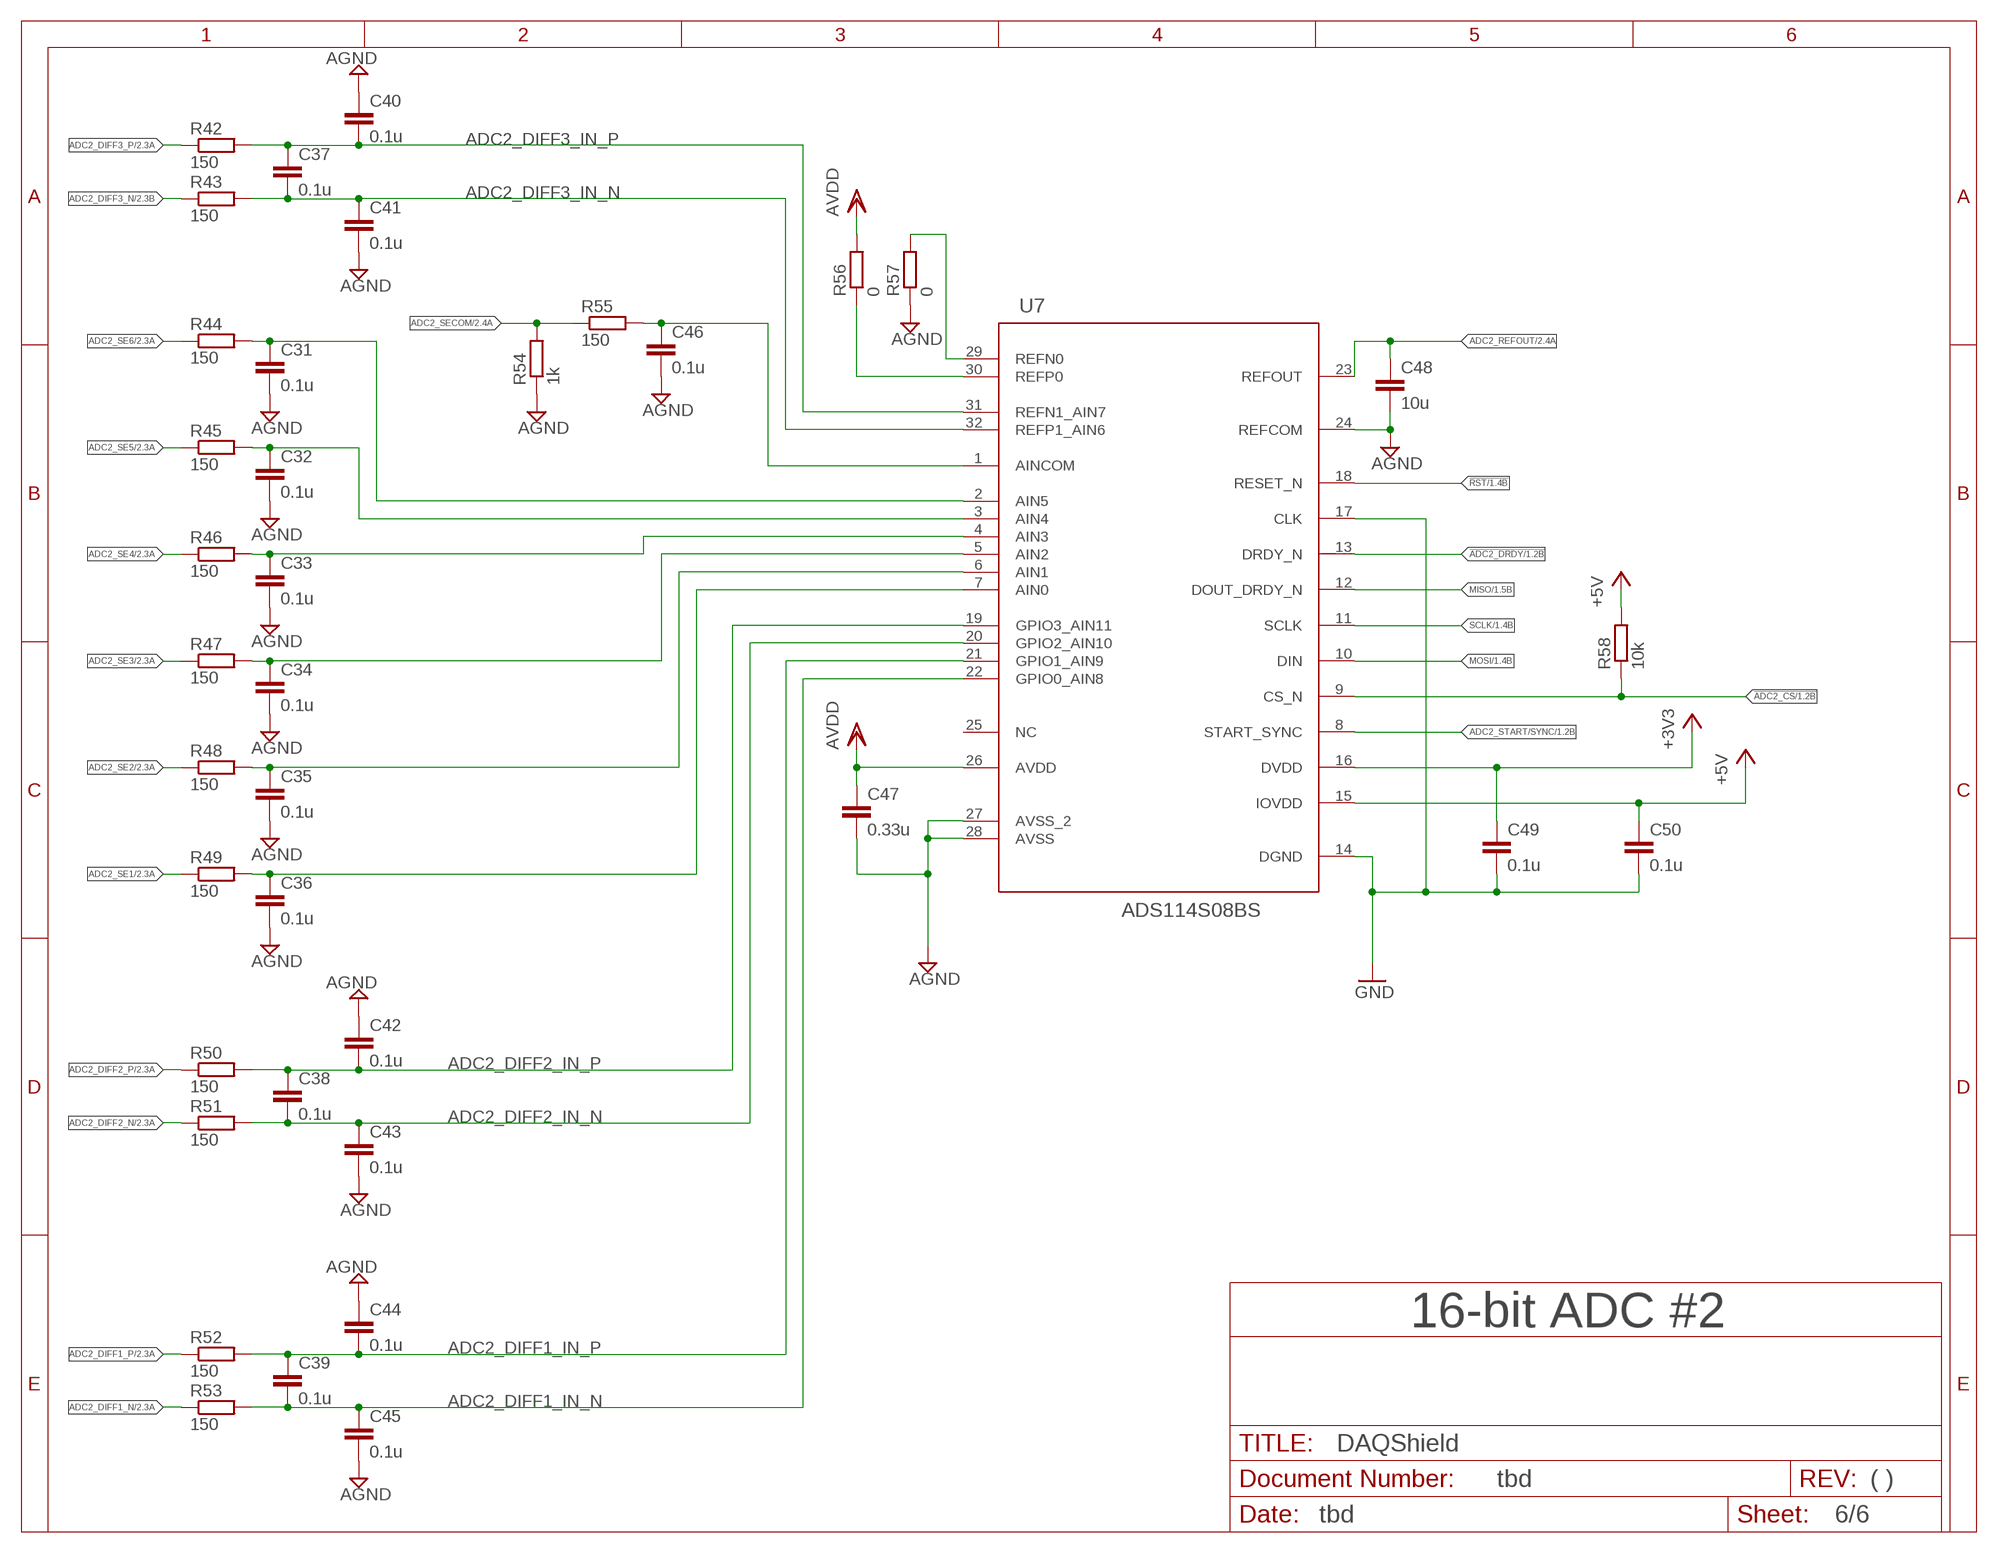
[diagram p5: schematic, sheet 6]

### Parts
C31  0.1u  C-EUC0603  [C0603]
C32  0.1u  C-EUC0603  [C0603]
C33  0.1u  C-EUC0603  [C0603]
C34  0.1u  C-EUC0603  [C0603]
C35  0.1u  C-EUC0603  [C0603]
C36  0.1u  C-EUC0603  [C0603]
C37  0.1u  C-EUC0603  [C0603]
C38  0.1u  C-EUC0603  [C0603]
C39  0.1u  C-EUC0603  [C0603]
C40  0.1u  C-EUC0603  [C0603]
C41  0.1u  C-EUC0603  [C0603]
C42  0.1u  C-EUC0603  [C0603]
C43  0.1u  C-EUC0603  [C0603]
C44  0.1u  C-EUC0603  [C0603]
C45  0.1u  C-EUC0603  [C0603]
C46  0.1u  C-EUC0603  [C0603]
C47  0.33u  C-EUC0603  [C0603]
C48  10u  C-EUC0603  [C0603]
C49  0.1u  C-EUC0603  [C0603]
C50  0.1u  C-EUC0603  [C0603]
R42  150  R-EU_R0603  [R0603]
R43  150  R-EU_R0603  [R0603]
R44  150  R-EU_R0603  [R0603]
R45  150  R-EU_R0603  [R0603]
R46  150  R-EU_R0603  [R0603]
R47  150  R-EU_R0603  [R0603]
R48  150  R-EU_R0603  [R0603]
R49  150  R-EU_R0603  [R0603]
R50  150  R-EU_R0603  [R0603]
R51  150  R-EU_R0603  [R0603]
R52  150  R-EU_R0603  [R0603]
R53  150  R-EU_R0603  [R0603]
R54  1k  R-EU_R0603  [R0603]
R55  150  R-EU_R0603  [R0603]
R56  0  R-EU_R0603  [R0603]
R57  0  R-EU_R0603  [R0603]
R58  10k  R-EU_R0603  [R0603]
U7  ADS114S08BS  ADS114S08BIPBS  [PBS0032A_N]

### Nets
!ADC2_CS: R58.1 U7.9(CS_N) ; also sheet 1
!ADC2_DRDY: U7.13(DRDY_N) ; also sheet 1
!RST: U7.18(RESET_N) ; also sheet 1,3,5
+3V3 [Power]: C49.1 U7.16(DVDD) ; also sheet 3,5
+5V [Power]: C50.1 R58.2 U7.15(IOVDD) ; also sheet 1,2,3,4,5
ADC2_DIFF1_IN_N [diff pairs]: C39.2 C45.1 R53.2 U7.22(GPIO0_AIN8)
ADC2_DIFF1_IN_P [diff pairs]: C39.1 C44.2 R52.2 U7.21(GPIO1_AIN9)
ADC2_DIFF1_N [diff pairs]: R53.1 ; also sheet 2
ADC2_DIFF1_P [diff pairs]: R52.1 ; also sheet 2
ADC2_DIFF2_IN_N [diff pairs]: C38.2 C43.1 R51.2 U7.20(GPIO2_AIN10)
ADC2_DIFF2_IN_P [diff pairs]: C38.1 C42.2 R50.2 U7.19(GPIO3_AIN11)
ADC2_DIFF2_N [diff pairs]: R51.1 ; also sheet 2
ADC2_DIFF2_P [diff pairs]: R50.1 ; also sheet 2
ADC2_DIFF3_IN_N [diff pairs]: C37.2 C41.1 R43.2 U7.32(REFP1_AIN6)
ADC2_DIFF3_IN_P [diff pairs]: C37.1 C40.2 R42.2 U7.31(REFN1_AIN7)
ADC2_DIFF3_N [diff pairs]: R43.1 ; also sheet 2
ADC2_DIFF3_P [diff pairs]: R42.1 ; also sheet 2
ADC2_REFOUT: C48.1 U7.23(REFOUT) ; also sheet 2
ADC2_SE1: R49.1 ; also sheet 2
ADC2_SE2: R48.1 ; also sheet 2
ADC2_SE3: R47.1 ; also sheet 2
ADC2_SE4: R46.1 ; also sheet 2
ADC2_SE5: R45.1 ; also sheet 2
ADC2_SE6: R44.1 ; also sheet 2
ADC2_SECOM: R54.2 R55.1 ; also sheet 2
ADC2_START/SYNC: U7.8(START_SYNC) ; also sheet 1
AGND [Ground]: C31.2 C32.2 C33.2 C34.2 C35.2 C36.2 C40.1 C41.2 C42.1 C43.2 C44.1 C45.2 C46.2 C47.2 C48.2 R54.1 R57.1 U7.24(REFCOM) U7.27(AVSS_2) U7.28(AVSS) ; also sheet 2,5
AVDD [Power]: C47.1 R56.2 U7.26(AVDD) ; also sheet 2,5
GND [Ground]: C49.2 C50.2 U7.14(DGND) U7.17(CLK) ; also sheet 1,2,3,4,5
MISO: U7.12(DOUT_DRDY_N) ; also sheet 1,2,5
MOSI: U7.10(DIN) ; also sheet 1,2,5
N$64: C36.1 R49.2 U7.7(AIN0)
N$65: C35.1 R48.2 U7.6(AIN1)
N$66: C34.1 R47.2 U7.5(AIN2)
N$67: C33.1 R46.2 U7.4(AIN3)
N$68: C32.1 R45.2 U7.3(AIN4)
N$69: C31.1 R44.2 U7.2(AIN5)
N$70: C46.1 R55.2 U7.1(AINCOM)
N$74: R57.2 U7.29(REFN0)
N$75: R56.1 U7.30(REFP0)
SCLK: U7.11(SCLK) ; also sheet 1,2,5
Unconnected: U7.25(NC)

## Library data of the parts
A1 = DAQParts:ARDUINO_PRO_MICRO
C1-C51 = rcl:C-EU: CAPACITOR, European symbol; SPICEPREFIX: C
D1 = diode:SMF5.0AT1: 200 W Transient Voltage Suppressor Source: Data sheet <http://www.onsemi.com/pub_link/Collateral/SMF5.0AT1-D.PDF>
IC1 = 74xx-little-us:74*1G08: 2-input AND gate
J1 J2 = WR-PHD:6100XX13321_61001213321: WR-PHD 2.54 mm SMT Socket Header ARTICLE PROPERTIES: Pins:4;​ 5;​ 6;​ 8;​ 10;​ 12;​ 14;​ 16;​ 20;​ 24 KIND PROPERTIES: Pitch：2.54 mm Quality Class:3 as per CECC 75 301-802 Rows：Single Gender：Socket Header Type：Straight Type 1;​ Straight Type 2 MATERIAL PROPERTIES: Insulator Material :Nylon 46 Insulator Flammability Rating:UL94 V-0 Contact Material:Copper Alloy Contact Plating:Gold Contact Type:Stamped GENERAL INFORMATION Operating Temperature:-40 up to +125 °C Compliance:Lead free / RoHS ELECTRICAL PROPERTIES: Rated Current:3 A IR 1:3 A Withstanding Voltage:500 V (AC) Contact Resistance:20 mΩ RISO:1000 MΩ CERTIFICATION UL Approval:E323964 PACKAGING PROPERTIES Packaging:Tube <https://katalog.we-online.com/media/images/v2/o64612v209%20Family_WR-PHD_6100xx13321.jpg> Details see: https://katalog.we-online.com/en/em/PHD_2_54_SMT_SOCKET_HEADER_6100XXXXX21 Updated by Yingchun,Shan 2019-10-23 2019 (C) Würth Elektronik; DATASHEET-URL: https://katalog.we-online.com/em/datasheet/61001213321.pdf; GENDER: Socket Header; IR: 3A; MATES: WR-PHD 2.54mm SMT Pin Header/THT Angled Pin Header/THT Pin Header; PACKAGING: Tube; PART-NUMBER: 61001213321; PINS: 12; ROWS: Single; TYPE: Straight Type 2
J3 J4 J6 = WR-MJ:634008149821: WR-MJ Modular Jack Horizontal Shielded SMT 8P8C Tab Up KIND PROPERTIES Quality Class:500 Mating cycles General Information Operating Temperature:-40 up to +85 °C Compliance:RoHS Electrical Properties IR1:1.5A Working Voltage:120V (AC) Withstanding Voltage:1000V (AC) Contact Resistance:20mΩ RISO:500 MΩ Material Properties Insulator MateriaL:PA9T Insulator Flammability Rating:UL94 V-0 Color:Black Cover Material Brass Cover Plating Nickel Contact Material Copper Alloy Contact Plating:Selective Gold Contact Type:Stamped Shielding Material:Brass Shielding Plating:Nickel Packaging Properties Packaging:Tray <https://www.we-online.com/catalog/media/o60696v209%20Family_WR-MJ_Horizontal_Shielded_634008149821_pf2.jpg> Details see: https://www.we-online.com/catalog/en/MJ_SMT_HORIZONTAL_SHIELDED_8P8C_TAB_UP/ Updated by Yingchun,Shan 2019-11-26 2019 (C) Würth Elektronik; DATASHEET-URL: https://www.we-online.com/catalog/datasheet/634008149821.pdf; MOUNT: SMT; PART-NUMBER: 634008149821; TYPE: Horizontal; XPXC: 8P8C
J5 = WR-DSUB:6180XX330923_618044330923: WR-DSUB Female High Density Angled PCB Connector w. Hex Screw Kind Properties Gender:Female Type:Angled Insulator Material:PBT Insulator Flammability Rating:UL94 V-0 Color:Black Contact Material:Copper Alloy Contact Plating:Selective Gold Contact Type:Stamped Shielding Material:Steel Shielding Plating:Nickel General Information Operating Temperature:-55 up to +105 °C Electrical Properties Working Voltage:60V (AC) Withstanding Voltage:1000 V (AC) Contact Resistance:30 mΩ <https://www.we-online.com/catalog/media/o33093v209%20Family_WR-DSUB_6180xx330923.jpg> Details see: https://www.we-online.com/catalog/en/DSUB_FEMALE_HIGH_DENSITY_ANGLED_PCB_CONNECTOR_W_HEX_SCREW_6180XX330923/ Updated by Yingchun, Shan 2020-01-14 2020 (C) Würth Elektronik; WE-NUMBER: 618044330923
L1 = DAQParts:SRU8043-XXXX; BUILT_BY: EMA_UL_Team; MANUFACTURER_PART_NUMBER: SRU8043-xxxx; SOURCELIBRARY: Bourns_2010-01-01_IND_SRUxxxx; VENDOR: Bourns Electronics
LED1 = DAQParts:APA1606QBC/D; BUILT_BY: EMA_Justin; COPYRIGHT: Copyright (C) 2018 Accelerated Designs. All rights reserved; MANUFACTURER_PART_NUMBER: APA1606QBC/D; SOURCELIBRARY: Kingbright_2018-12-15; VENDOR: Kingbright
R1-R20 R22-R62 = rcl:R-EU_: RESISTOR, European symbol; SPICEPREFIX: R
S1 = WS-TASV:434153017835: WS-TASV J-Bend SMT Tact Switch 3.5x2.9 mm Material Properties Cover Material : Stainless Steel Properties Actuator Material:LCP Actuator Flammability Rating:UL94 V-0 Actuator Color:Blue Frame Material:PA46 Frame Flammability Rating:UL94 HB Frame Color:Black Contact Material:Stainless Steel Contact Plating:Silver Terminal Material:Copper Alloy Terminal Plating:Silver VR:12 V (DC) Contact Resistance Initial:100 mΩ Contact Resistance After Life Test:1 Ω RISO:100 MΩ Withstanding Voltage:250 V (AC) Washable:No Qty.:4000 Mechanical Properties Stroke :0.15 mm General Information Operating Temperature:-40 up to +85 °C Washable:No Packaging Properties Packaging:Tape and Reel <https://www.we-online.com/catalog/media/o72753v209%20WS-TASU_434331013822_a_4C.jpg> Details see: https://www.we-online.com/catalog/en/TASV_3_5X2_9_SMD_J-BEND/ Updated by yingchun,Shan;2020-02-18 2020(C) Würth Elektronik; DATASHEET-URL: https://www.we-online.com/catalog/datasheet/434153017835.pdf; H: 1.7mm; OPERATION-FORCE: 350g; PART-NUMBER: 434153017835; QTY: 4000
S2 S4 = WS-SLSU:450404015514: WS-SLSU Mini Slide Switch, Same Side Connection Side Push 6.7x2.7 mm Properties Actuator Material:PA46 Actuator Flammability Rating:UL94 HB Actuator Color:Black Frame Material:LCP Frame Flammability Rating:UL94 V-0 Frame Color:Black Contact Material:Copper Alloy Contact Plating:Silver Terminal Material:Copper Alloy Terminal Plating:Silver Switching Function:On-On Schematic:SPDT Connection Type:Same Side Connection Qty.:3300 Material Properties Cover Material:Stainless Steel General Information Operating Temperature:-40 up to +85 °C Packaging Properties Packaging :Tape and Reel <https://www.we-online.com/catalog/media/o76706v209%20Family_WS-SLSU_Gruppe.jpg> Details see: https://www.we-online.com/catalog/en/SLSU_6_7X_2_7_SMD_HORIZONTAL/ Updated by yingchun,Shan;2020-02-25 2020(C) Würth Elektronik; DATASHEET-URL: https://www.we-online.com/catalog/datasheet/450404015514.pdf; IR: 300mA; PACKAGING: Tape and Reel; PART-NUMBER: 450404015514; QTY: 150; VR: 5V(DC)
S3 = WS-ROTU:428427320910: WS-ROTU THT Rotary Switch Right Angled with Arrow Type Actuator, 2.54 mm Pitch, 10x10 mm Material Properties Cover Material : PA66 Packaging Properties Packaging :Tube Electrical Properties IR 1 :150 mA Properties Actuator Materia:POM Actuator Flammability Rating:UL94 HB Actuator Color:Dark Grey; Ivory Base Material:PA66 Base Flammability Rating:UL94 V-0 Terminal Plating:Gold Actuator Type:Arrow Type Washable:Yes Mechanical Properties Electrical Life：10000 Steps Actuator Type：Arrow Type Code：Complement Code; Real Code General Information Operating Temperature:-40 up to +85 °C Tableadditional Actuator Type：Arrow Type Washable：Yes <https://www.we-online.com/catalog/media/o61126v209%20Family_WS_RAT_10x10_THT_42842732091x_pf2.jpg> Details see: https://www.we-online.com/catalog/en/ROTU_10X10_WASHABLE_THT_RIGHT_ANGLED_ARROW_TYPE_PITCH_2_54/ Updated by yingchun,Shan;2020-02-24 2020(C) Würth Elektronik; DATASHEET-URL: https://www.we-online.com/catalog/datasheet/428427320910.pdf; NUMBER-OF-POSITION: 10; PART-NUMBER: 428427320910; QTY: 50
S5 = WS-SLSV:452403012014: WS-SLSV SMD Mini Slide Switch, Same Side Connection 7.65 x 5.5 mm Properties Actuator Material:LCP Actuator Flammability Rating:UL94 V-0 Actuator Color:Black Frame Material:PA6T Frame Flammability Rating:UL94 V-0 Frame Color:Black Contact Material:Copper Alloy Contact Plating:Silver Terminal Material:Copper Alloy Terminal Plating:Silver VR:6 V (DC) VR:6 V (DC) Contact Resistance Initial:50 mΩ Contact Resistance After Life Test:200 mΩ RISO:100 MΩ Withstanding Voltage:500 V (AC) Qty.:1500 Electrical Properties IR:300 mA Mechanical Properties Operation Force:350g Packaging Properties Packaging :Tape and Reel <https://www.we-online.com/catalog/media/o64640v209%20Family_WS-SLSV_452403012014.jpg> Details see: https://www.we-online.com/catalog/en/SLSV_7_65X_5_5_SMD_VERTICAL/ Updated by yingchun,Shan;2020-02-25 2020(C) Würth Elektronik; DATASHEET-URL: https://www.we-online.com/catalog/datasheet/452403012014.pdf; PACKAGING: Tape and Reel; PART-NUMBER: 452403012014; QTY: 350
U1 = DAQParts:74LVC1G125DBVRE4; MANUFACTURER: Texas Instruments; PARTNUMBER: SN74LVC1G125DBVR; REFDES: RefDes; TYPE: TYPE
U2 = DAQParts:LV2862XLVDDCR; MANUFACTURER: Texas Instruments; PARTNUMBER: LV2862YDDCR; REFDES: RefDes; TYPE: TYPE
U3 = DAQParts:TPS3828-50DBVT: Check prices <https://pricing.snapeda.com/parts/TPS3828-50DBVT/Texas%20Instruments/view-part?ref=eda>; AVAILABILITY: No availability data; DESCRIPTION: Automotive voltage monitor with watchdog timer 5-SOT-23 -40 to 125; MF: Texas Instruments; MP: TPS3828-50DBVT; PACKAGE: SOT-23-5 Texas Instruments; PRICE: None; PURCHASE-URL: https://pricing.snapeda.com/search/part/TPS3828-50DBVT/?ref=eda
U4 = DAQParts:XC6206P302MR: Linear Voltage Regulator IC 1 Output 200mA SOT-23 Check prices <https://pricing.snapeda.com/parts/XC6206P302MR/Torex/view-part?ref=eda>; AVAILABILITY: In Stock; DESCRIPTION: Linear Voltage Regulator IC Positive Fixed 1 Output 200mA SOT-23; MF: Torex; MP: XC6206P302MR; PACKAGE: SOT-23-3 Torex; PRICE: None
U5 = DAQParts:MAX3491ECSD+: Check prices <https://pricing.snapeda.com/parts/MAX3491ECSD%2B/Maxim%20Integrated/view-part?ref=eda>; AVAILABILITY: In Stock; DESCRIPTION: 1/1 Transceiver RS422, RS485 14-SOIC; MF: Maxim Integrated; MP: MAX3491ECSD+; PACKAGE: SOIC-14 Maxim; PRICE: None
U6 U7 = DAQParts:ADS114S08BIPBS; MANUFACTURER: Texas Instruments; PARTNUMBER: ADS114S08BIPBSR; REFDES: RefDes; TYPE: TYPE; VALUE: Value

## Net classes
0 Default: width 0.203 mm, drill 0.305 mm, clearance 0.152 mm
1 Ground: width 0.254 mm, drill 0.305 mm, clearance 0.152 mm to class 0, clearance 0.152 mm
2 Power: width 0.254 mm, drill 0.305 mm, clearance 0.152 mm to class 0, clearance 0.152 mm to class 1, clearance 0.152 mm
3 diff pairs: width 0.203 mm, drill 0.305 mm, clearance 0.152 mm to class 0, clearance 0.152 mm to class 1, clearance 0.152 mm to class 2, clearance 0.152 mm